# Altium schematic sheet ESS-BoB - ESS Interface.SchDoc: ESS-BoB
size A4; DrawnBy: Guy Ovadia; Engineer: Guy Ovadia; Organization: TAMI Hackerspace; DocumentNumber: xxx; Revision: REV_NOT_USED
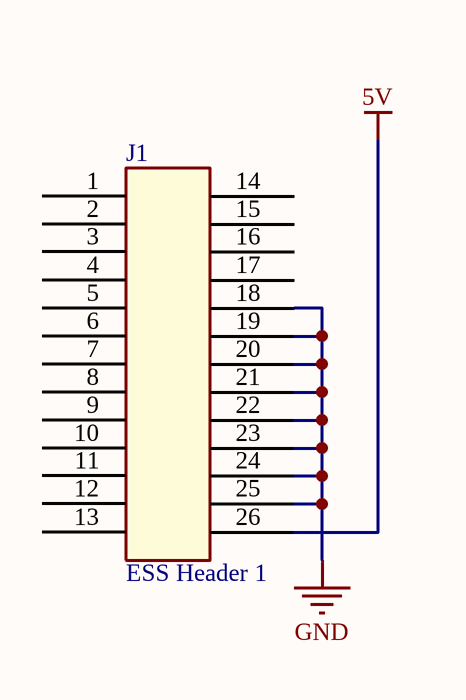
[diagram p0: ESS-BoB - ESS Interface.SchDoc]

## Parts
J1  ESS Header 1  [Samtec ESQ-113-33-G-D]

## Nets
5V: J1.26
GND: J1.18 J1.19 J1.20 J1.21 J1.22 J1.23 J1.24 J1.25

Not connected (* = marked no-connect by the designer): J1 1 2 3 4 5 6 7 8 9 10 11 12 13 14 15 16 17

## Notes on the sheet
- Date:
- Revision:
- Sheet
- P/N:
- of
- File:
- Size:
- A4

## Library data of the parts
J1 = CON2x13 Alt. Numbering: Manufacturer 1: Samtec Inc.; Manufacturer Part Number 1: ESQ-113-33-G-D; Description 1: ELEVATED SOCKET STRIPS; Category 1: Connectors, Interconnects; Connector Type: Elevated Socket; Style: Board to Board; Number of Positions: 26; Number of Positions Loaded: All; Pitch - Mating: 0.100" (2.54mm); Contact Length - Post: 0.090" (2.29mm); Material Flammability Rating: UL94 V-0; Current Rating: 5.7A per Contact; Voltage Rating: 550VAC; Supplier 1: Digi-Key; Supplier Part Number 1: SAM11103-ND; RoHS 1: RoHS Compliant; Pricing 1: 1=6.24, 10=5.28, 100=4.08, 500=3.36, 1000=3.12 (USD); Packaging: Tube; Part Status: Active; Contact Type: Forked; Row Spacing - Mating: 0.100" (2.54mm); Mounting Type: Through Hole; Termination: Solder; Fastening Type: Push-Pull; Contact Finish - Mating: Gold; Contact Finish Thickness - Mating: 20.0µin (0.51µm); Insulation Color: Black; Insulation Height: 0.635" (16.13mm); Operating Temperature: -55°C ~ 125°C; Contact Finish - Post: Gold; Mated Stacking Heights: -; Ingress Protection: -; Features: -; Applications: -; Insulation Material: Liquid Crystal Polymer (LCP); Contact Shape: Square; Contact Material: Phosphor Bronze; Contact Finish Thickness - Post: 3.00µin (0.076µm); ComponentLink1URL: http://suddendocs.samtec.com/prints/esq-1xx-xx-x-x-xxx-xx-x-xx-mkt.pdf; ComponentLink1Description: http://suddendocs.samtec.com/prints/esq-1xx-xx-x-x-xxx-xx-x-xx-mkt.pdf